# EAGLE design sensor_35mm (EAGLE 7.6.0)
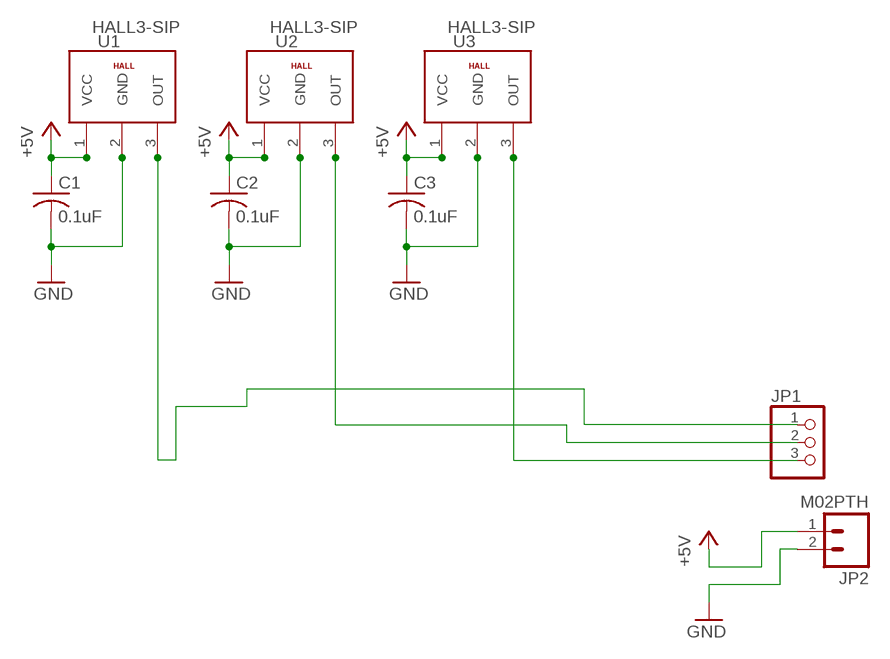
[diagram p0: schematic, sheet 1]

## Parts
C1  0.1uF  C-USC0603  [C0603]
C2  0.1uF  C-USC0603  [C0603]
C3  0.1uF  C-USC0603  [C0603]
JP1  PINHD-1X3CB  [1X03-CLEANBIG]
JP2  M02PTH  [1X02]
U1  HALL3-SIP  [3PINS1,27]
U2  HALL3-SIP  [3PINS1,27]
U3  HALL3-SIP  [3PINS1,27]

## Nets
+5V: C1.1 C2.1 C3.1 JP2.1 U1.1(VCC) U2.1(VCC) U3.1(VCC)
GND: C1.2 C2.2 C3.2 JP2.2 U1.2(GND) U2.2(GND) U3.2(GND)
N$2: JP1.1 U1.3(OUT)
N$4: JP1.3 U3.3(OUT)
N$7: JP1.2 U2.3(OUT)

## Library data of the parts
C1-C3 = rcl:C-US: CAPACITOR, American symbol
JP1 = adafruit:PINHD-1X3: PIN HEADER
JP2 = SparkFun-Connectors:M02: Standard 2-pin 0.1" header. Use with - straight break away headers ( PRT-00116) - right angle break away headers (PRT-00553) - swiss pins (PRT-00743) - machine pins (PRT-00117) - female headers (PRT-00115) Molex polarized connector foot print use with: PRT-08233 with associated crimp pins and housings. 2.54_SCREWTERM for use with PRT-10571. 3.5mm Screw Terminal footprints for PRT-08084 5mm Screw Terminal footprints for use with PRT-08432
U1-U3 = charleses_parts_bin:HALL

## Board
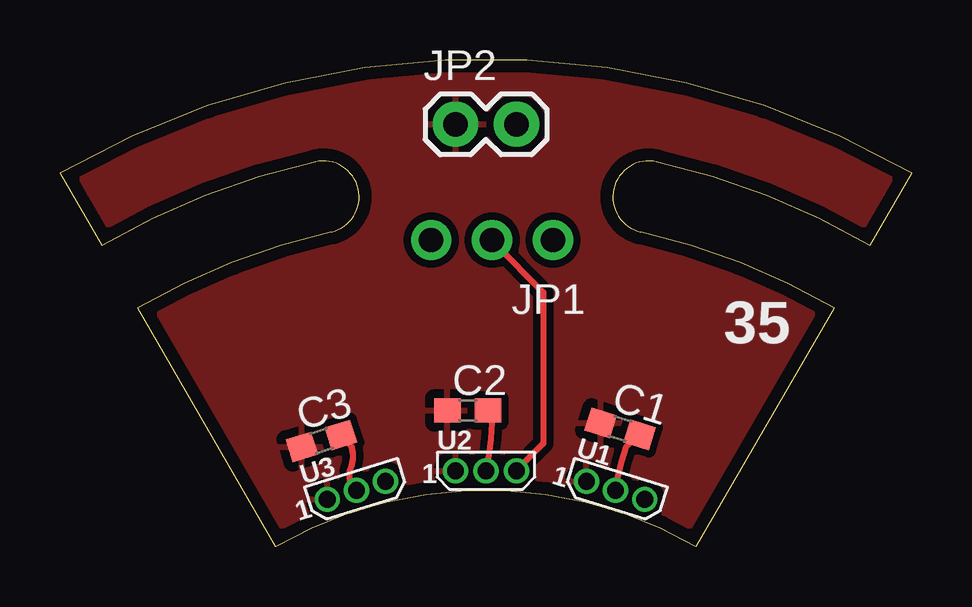
[diagram p1: board, top side]
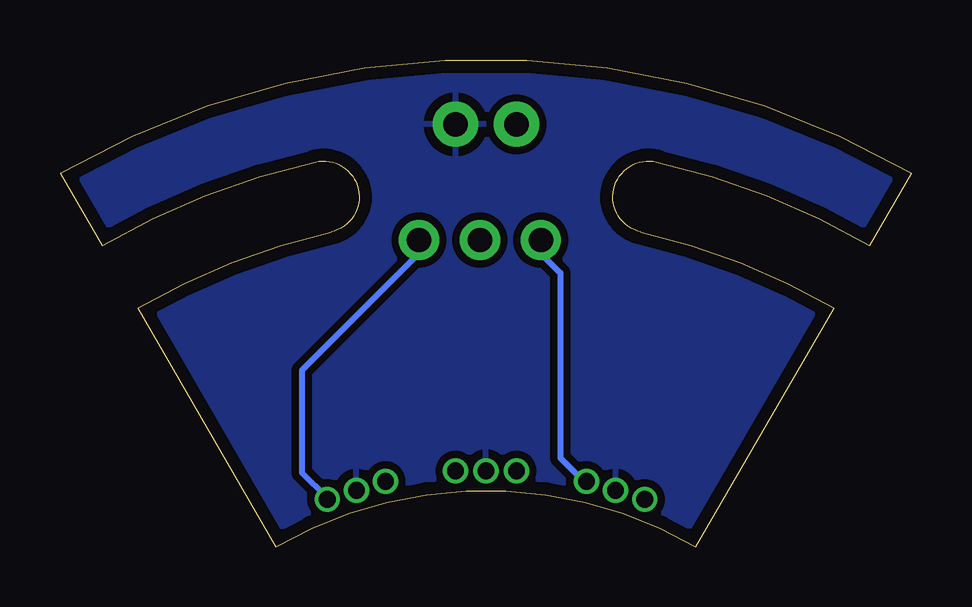
[diagram p2: board, bottom side, seen from below]

Size 35.5 x 20.29 mm. Coordinates in mm from the lower left corner, seen from the top.
Outline: 32.25,9.96 arc17 24.2,13.12 arc-180 24.87,16.04 arc-17 33.75,12.55 35.5,15.58 arc60 0,15.58 1.75,12.55 arc-17 10.63,16.04 arc-180 11.3,13.12 arc17 3.25,9.96 9,0 arc-60 26.5,0 32.25,9.96
Copper layers (1*16): Top 0.035mm / dielectric 1.5mm / Bottom 0.035mm
Design rules "charlesg_1oz *": minimum track width 10mil, minimum drill 16mil, track to track 6mil, track to pad 6mil, pad to pad 6mil, via to via 6mil, smd to smd 6mil, copper to edge 20mil, drill to drill 8mil, minimum pad ring 6mil, minimum via ring 8mil, stop-mask expansion 4mil, vias tented up to drill 0mil, thermal gap 15mil

### Footprints (pad centres in the part's own frame; a part is rotated, then mirrored left to right if it is on the bottom)
C0603 = smd 1.1 x 1: 1 -0.85,0; 2 0.85,0
1X03-CLEANBIG = drill 1.016 pad 1.676: 1 -2.54,0; 2 0,0; 3 2.54,0
1X02 = drill 1.016 pad 1.88: 1 0,0; 2 2.54,0
3PINS1,27 = drill 0.7 pad 1.016: 1 -1.27,0; 2 0,0; 3 1.27,0

### Placement (x,y rotation side)
C1  23.34,4.91 342.9 top
C2  16.99,5.67 0 top
C3  10.89,4.4 17.1 top
JP1  18,12.78 180 top
JP2  16.48,17.61 0 top
U1  23.15,2.34 342.9 top
U2  17.75,3.16 0 top
U3  12.35,2.34 17.1 top

### Tracks (layer width: path | path; a pad name or v marks a point on that pad's centre or on a via)
+5V
  pour Top (isolate 0.305): -5.87,21.17 -5.87,-0.93 41.88,-0.93 41.88,21.17
GND
  Top 0.254: C3.2 12.16,4.15 arc-30 12.16,3.39 arc74 U3.2 | C2.2 18,5.16 arc-12 U2.2 | C1.2 23.59,4.15 arc11 U1.2
  pour Bottom (isolate 0.305): -5.87,21.17 -5.87,-0.93 41.88,-0.93 41.88,21.17
N$2
  Bottom 0.254: JP1.1 20.54,12.22 25.42,7.35 25.42,3.08 24.4,2.06 U1.3
N$4
  Bottom 0.254: JP1.3 15.46,12.22 14.65,11.41 14.65,3.69 13.84,2.88 13.63,2.88 U3.3
N$7
  Top 0.254: U2.3 19.12,3.28 20.14,4.3 20.14,10.6 18.11,12.63 JP1.2

### Text on the board
tPlace: 35